# EAGLE design H-Bridge V.1 (EAGLE 5.06)
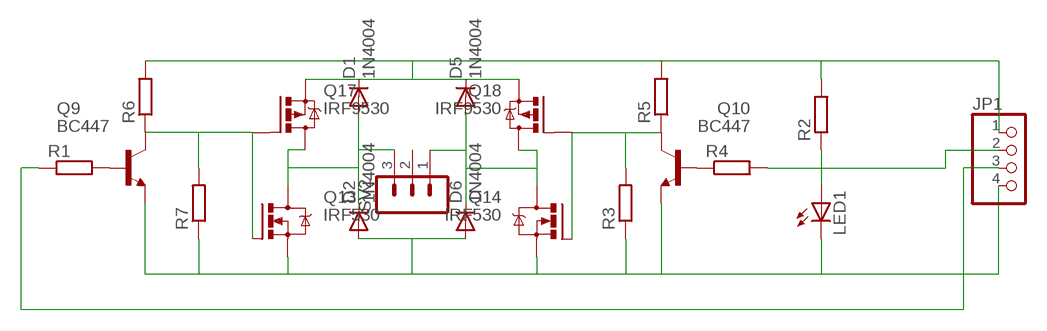
[diagram p0: schematic, sheet 1]

## Parts
D1  1N4004  [DO41-10]
D2  1N4004  [DO41-10]
D5  1N4004  [DO41-10]
D6  1N4004  [DO41-10]
JP1  PINHD-1X4  [1X04]
LED1  LED3MM  [LED3MM]
Q9  BC447  [TO92-EBC]
Q10  BC447  [TO92-EBC]
Q13  IRF530  [TO220BV]
Q14  IRF530  [TO220BV]
Q17  IRF9530  [TO220BV]
Q18  IRF9530  [TO220BV]
R1  R-EU_0207/10  [0207/10]
R2  R-EU_0204/5  [0204/5]
R3  R-EU_0204/7  [0204/7]
R4  R-EU_0207/10  [0207/10]
R5  R-EU_0207/10  [0207/10]
R6  R-EU_0207/10  [0207/10]
R7  R-EU_0204/7  [0204/7]
SV2  MA03-1  [MA03-1]

## Nets
+12V: D1.C D5.C JP1.1 Q17.S Q18.S R2.2 R5.2 R6.2
GND: D2.A D6.A JP1.4 LED1.K(C) Q9.E Q10.E Q13.S Q14.S R3.1 R7.1
N$1: Q9.B R1.2
N$2: Q10.B R4.1
N$7: D5.A D6.C Q14.D Q18.D SV2.1
N$8: D1.A D2.C Q13.D Q17.D SV2.3
N$9: LED1.A R2.1
N$12: Q10.C Q14.G Q18.G R3.2 R5.1
N$18: Q9.C Q13.G Q17.G R6.1 R7.2
PWM1: JP1.2 R4.2
PWM2: JP1.3 R1.1
Unconnected: SV2.2

## Library data of the parts
D1 D2 D5 D6 = diode:1N4004: DIODE general purpose rectifier, 1 A
JP1 = pinhead:PINHD-1X4: PIN HEADER
LED1 = led:LED: LED OSRAM: - CHIPLED LG R971, LG N971, LY N971, LG Q971, LY Q971, LO R971, LY R971 LH N974, LH R974 LS Q976, LO Q976, LY Q976 LO Q996 - Hyper CHIPLED LW Q18S LB Q993, LB Q99A, LB R99A - SideLED LS A670, LO A670, LY A670, LG A670, LP A670 LB A673, LV A673, LT A673, LW A673 LH A674 LY A675 LS A676, LA A676, LO A676, LY A676, LW A676 LS A679, LY A679, LG A679 - Hyper Micro SIDELED® LS Y876, LA Y876, LO Y876, LY Y876 LT Y87S - SmartLED LW L88C, LW L88S LB L89C, LB L89S, LG L890 LS L89K, LO L89K, LY L89K LS L896, LA L896, LO L896, LY L896 - TOPLED LS T670, LO T670, LY T670, LG T670, LP T670 LSG T670, LSP T670, LSY T670, LOP T670, LYG T670 LG T671, LOG T671, LSG T671 LB T673, LV T673, LT T673, LW T673 LH T674 LS T676, LA T676, LO T676, LY T676, LB T676, LH T676, LSB T676, LW T676 LB T67C, LV T67C, LT T67C, LS T67K, LO T67K, LY T67K, LW E67C LS E67B, LA E67B, LO E67B, LY E67B, LB E67C, LV E67C, LT E67C LW T67C LS T679, LY T679, LG T679 LS T770, LO T770, LY T770, LG T770, LP T770 LB T773, LV T773, LT T773, LW T773 LH T774 LS E675, LA E675, LY E675, LS T675 LS T776, LA T776, LO T776, LY T776, LB T776 LHGB T686 LT T68C, LB T68C - Hyper Mini TOPLED® LB M676 - Mini TOPLED Santana® LG M470 LS M47K, LO M47K, LY M47K Source: http://www.osram.convergy.de LUXEON: - LUMILED® LXK2-PW12-R00, LXK2-PW12-S00, LXK2-PW14-U00, LXK2-PW14-V00 LXK2-PM12-R00, LXK2-PM12-S00, LXK2-PM14-U00 LXK2-PE12-Q00, LXK2-PE12-R00, LXK2-PE12-S00, LXK2-PE14-T00, LXK2-PE14-U00 LXK2-PB12-K00, LXK2-PB12-L00, LXK2-PB12-M00, LXK2-PB14-N00, LXK2-PB14-P00, LXK2-PB14-Q00 LXK2-PR12-L00, LXK2-PR12-M00, LXK2-PR14-Q00, LXK2-PR14-R00 LXK2-PD12-Q00, LXK2-PD12-R00, LXK2-PD12-S00 LXK2-PH12-R00, LXK2-PH12-S00 LXK2-PL12-P00, LXK2-PL12-Q00, LXK2-PL12-R00 Source: www.luxeon.com KINGBRIGHT: KA-3528ASYC Source: www.kingbright.com
Q9 Q10 = transistor-npn:BC447*: NPN Transistor
Q13 Q14 = transistor-power:IRF530: HEXFET Power MOSFET
Q17 Q18 = transistor-power:IRF9530: P-CHANNEL HEXFET POWER-MOS-FET Source: http://www.irf.com/product-info/datasheets/data/irf9530.pdf
R1-R7 = resistor:R-EU_: RESISTOR, European symbol
SV2 = con-lstb:MA03-1: PIN HEADER

## Board
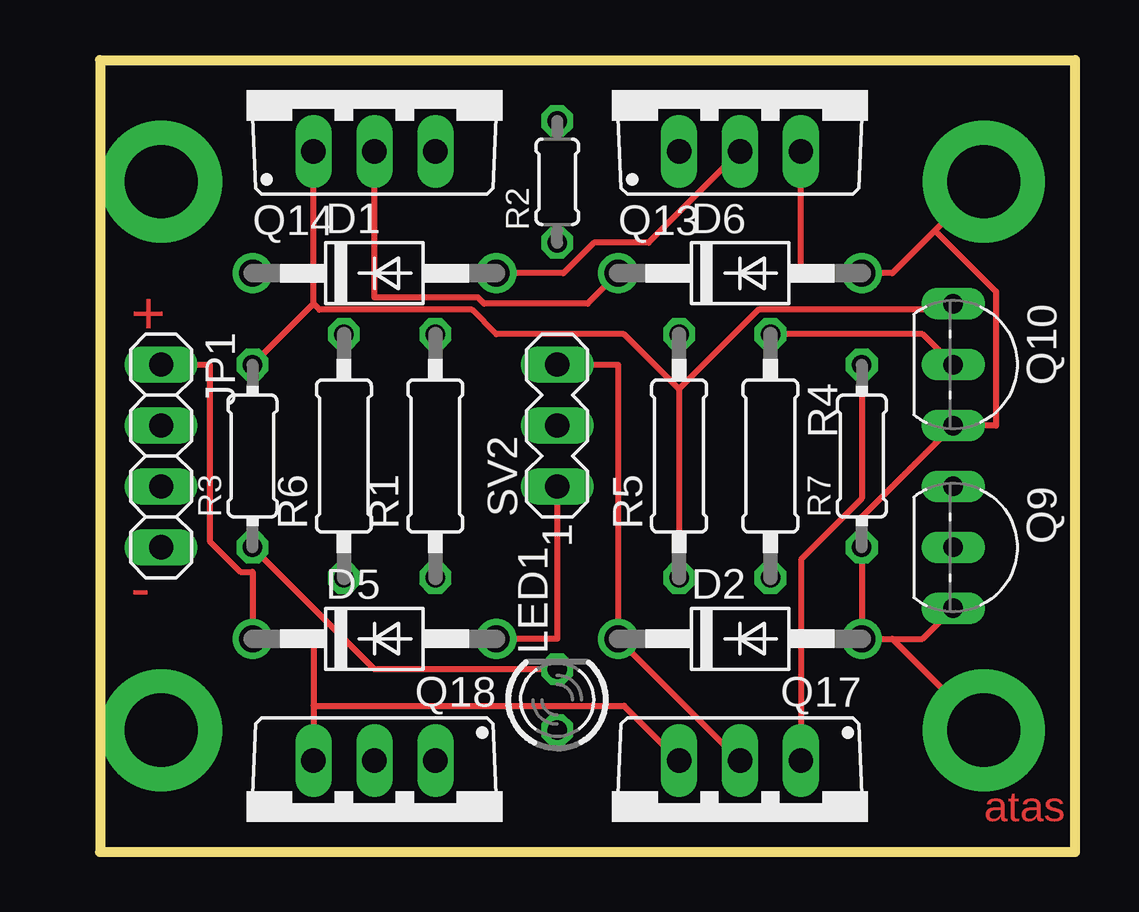
[diagram p1: board, top side]
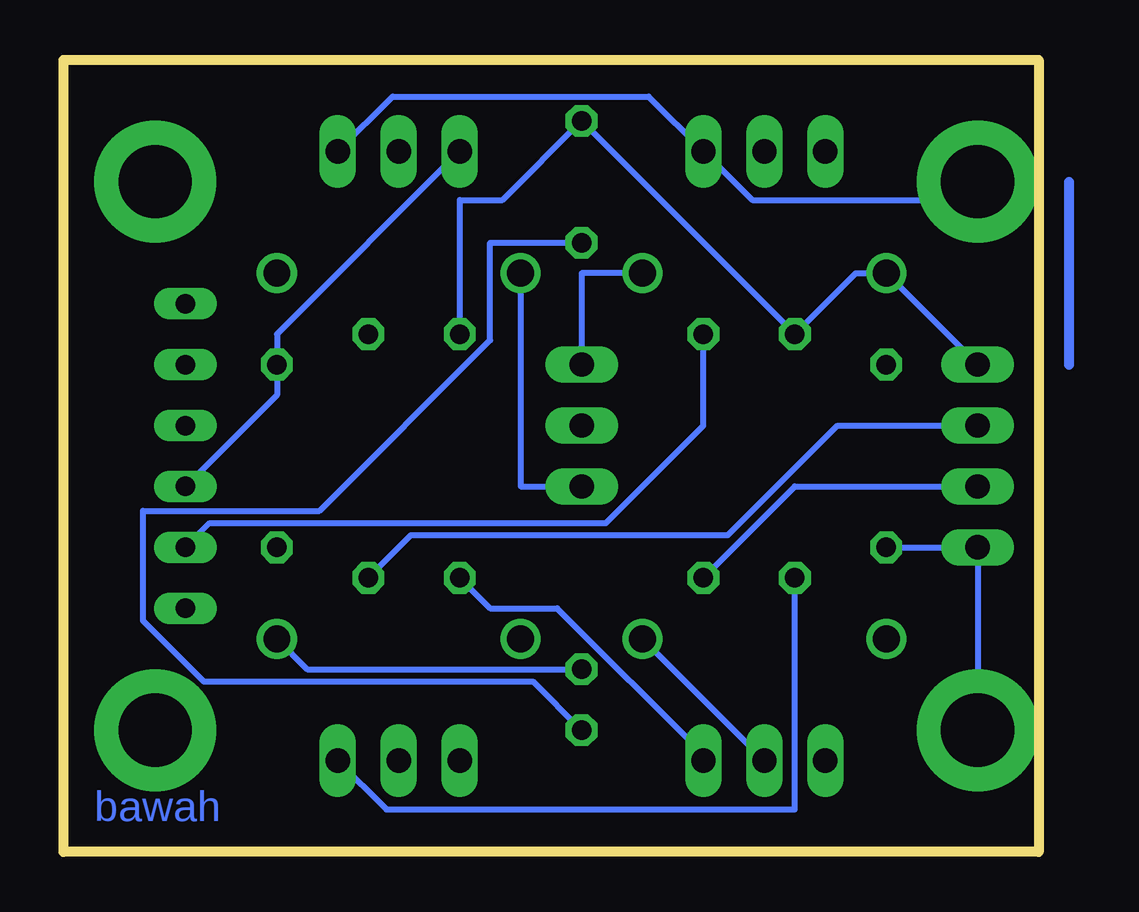
[diagram p2: board, bottom side, seen from below]

Size 40.64 x 33.02 mm. Coordinates in mm from the lower left corner, seen from the top.
Outline: 0,33.02 40.64,33.02 40.64,0 0,0 0,33.02
Copper layers (1*16): Top 0.035mm / dielectric 1.5mm / Bottom 0.035mm
Design rules "default": minimum track width 10mil, minimum drill 24mil, track to track 8mil, track to pad 8mil, pad to pad 8mil, via to via 8mil, smd to smd 8mil, copper to edge 40mil, drill to drill 8mil, minimum pad ring 10mil, minimum via ring 8mil, stop-mask expansion 4mil, vias tented up to drill 0mil, thermal gap 10mil

### Footprints (pad centres in the part's own frame; a part is rotated, then mirrored left to right if it is on the bottom)
DO41-10 = drill 1.118 round: A 5.08,0; C -5.08,0
1X04 = drill 1.016 long: 1 -3.81,0; 2 -1.27,0; 3 1.27,0; 4 3.81,0
LED3MM = drill 0.813 octagon: A -1.27,0; K 1.27,0
TO92-EBC = drill 0.813 long: B 0,-1.27; C -2.54,-1.27; E 2.54,-1.27
TO220BV = drill 1.016 long: D 0,-2.54; G -2.54,-2.54; S 2.54,-2.54
0207/10 = drill 0.813 octagon: 1 -5.08,0; 2 5.08,0
0204/5 = drill 0.813 octagon: 1 -2.54,0; 2 2.54,0
0204/7 = drill 0.813 octagon: 1 -3.81,0; 2 3.81,0
MA03-1 = drill 1.016 long: 1 -2.54,0; 2 0,0; 3 2.54,0

### Placement (x,y rotation side)
D1  11.43,24.13 0 top
D2  26.67,8.89 0 top
D5  11.43,8.89 0 top
D6  26.67,24.13 0 top
JP1  2.54,16.51 270 top
LED1  19.05,6.35 90 top
Q9  36.83,12.7 270 top
Q10  36.83,20.32 270 top
Q13  26.67,31.75 0 top
Q14  11.43,31.75 0 top
Q17  26.67,1.27 180 top
Q18  11.43,1.27 180 top
R1  13.97,16.51 90 top
R2  19.05,27.94 90 top
R3  6.35,16.51 90 top
R4  27.94,16.51 270 top
R5  24.13,16.51 90 top
R6  10.16,16.51 90 top
R7  31.75,16.51 90 top
SV2  19.05,17.78 90 top

### Tracks (layer width: path | path; a pad name or v marks a point on that pad's centre or on a via)
+12V
  Top 0.254: 8.89,6.1 8.89,8.89 D5.C 6.35,11.68 5.84,11.68 4.57,12.95 4.57,20.32 JP1.1 | 8.89,6.1 Q18.S | Q17.S 21.84,6.1 8.89,6.1
  Bottom 0.254: JP1.1 D1.C 7.62,24.13 R6.2 R2.2 22.35,27.18 24.13,27.18 R5.2
GND  (via drill 3.05 pad 5.08)
  Top 0.254: Q13.S 29.21,24.13 D6.A 33.02,24.13 34.8,25.91 | v36.83,27.94 34.8,25.91 | Q9.E 34.29,8.89 33.02,8.89 | 33.02,8.89 D2.A R7.1 31.75,13.97 Q10.E 37.34,17.78 37.34,23.37 34.8,25.91 | 33.02,8.89 v36.83,5.08 | R3.1 11.43,7.62 LED1.K
  Bottom 0.254: v2.54,27.94 3.3,27.18 11.94,27.18 Q14.S 16.26,31.5 26.92,31.5 Q13.S | R3.1 JP1.4 v2.54,5.08 | LED1.K 30.48,7.62 D2.A
N$1
  Bottom 0.254: Q9.B 34.54,13.72 18.03,13.72 13.97,17.78 R1.2
N$2
  Top 0.254: Q10.B 34.29,21.59 R4.1
N$4
  Bottom 0.406: -1.27,27.94 -1.27,20.32
N$7
  Top 0.254: Q14.D 11.43,23.11 15.75,23.11 16,22.86 20.32,22.86 D6.C | SV2.1 19.05,8.89 D5.A
  Bottom 0.254: D5.A Q18.D | D6.C 21.59,15.24 SV2.1
N$8
  Top 0.254: Q17.D D2.C 21.59,20.32 SV2.3 | Q13.D 22.86,25.4 20.57,25.4 19.3,24.13 D1.A
  Bottom 0.254: SV2.3 19.05,24.13 D1.A
N$9
  Bottom 0.254: LED1.A 21.08,7.11 34.8,7.11 37.34,9.65 37.34,14.22 29.97,14.22 22.86,21.34 22.86,25.4 R2.1
N$12
  Top 0.254: 8.89,22.86 R3.2 | 8.89,22.86 Q14.G | Q10.C 35.31,22.61 27.43,22.61 24.13,19.3 | 24.13,19.3 R5.1 | 8.89,22.86 9.14,22.61 15.49,22.61 16.51,21.59 21.84,21.59 24.13,19.3
  Bottom 0.254: R5.1 22.86,10.16 20.07,10.16 13.97,4.06 Q18.G
N$18
  Top 0.254: R7.2 31.75,14.73 29.21,12.19 Q17.G
  Bottom 0.254: Q9.C 31.75,19.05 R7.2 31.75,21.59 Q13.G | R6.1 10.16,1.78 27.18,1.78 Q17.G
PWM1
  Bottom 0.254: R4.2 26.16,13.21 12.95,13.21 8.38,17.78 JP1.2
PWM2
  Bottom 0.254: R1.1 10.16,15.24 JP1.3

### Text on the board
Top: + | - | atas
Bottom: bawah